# EAGLE design SI4689_Fm_Module (EAGLE 7.5.0)
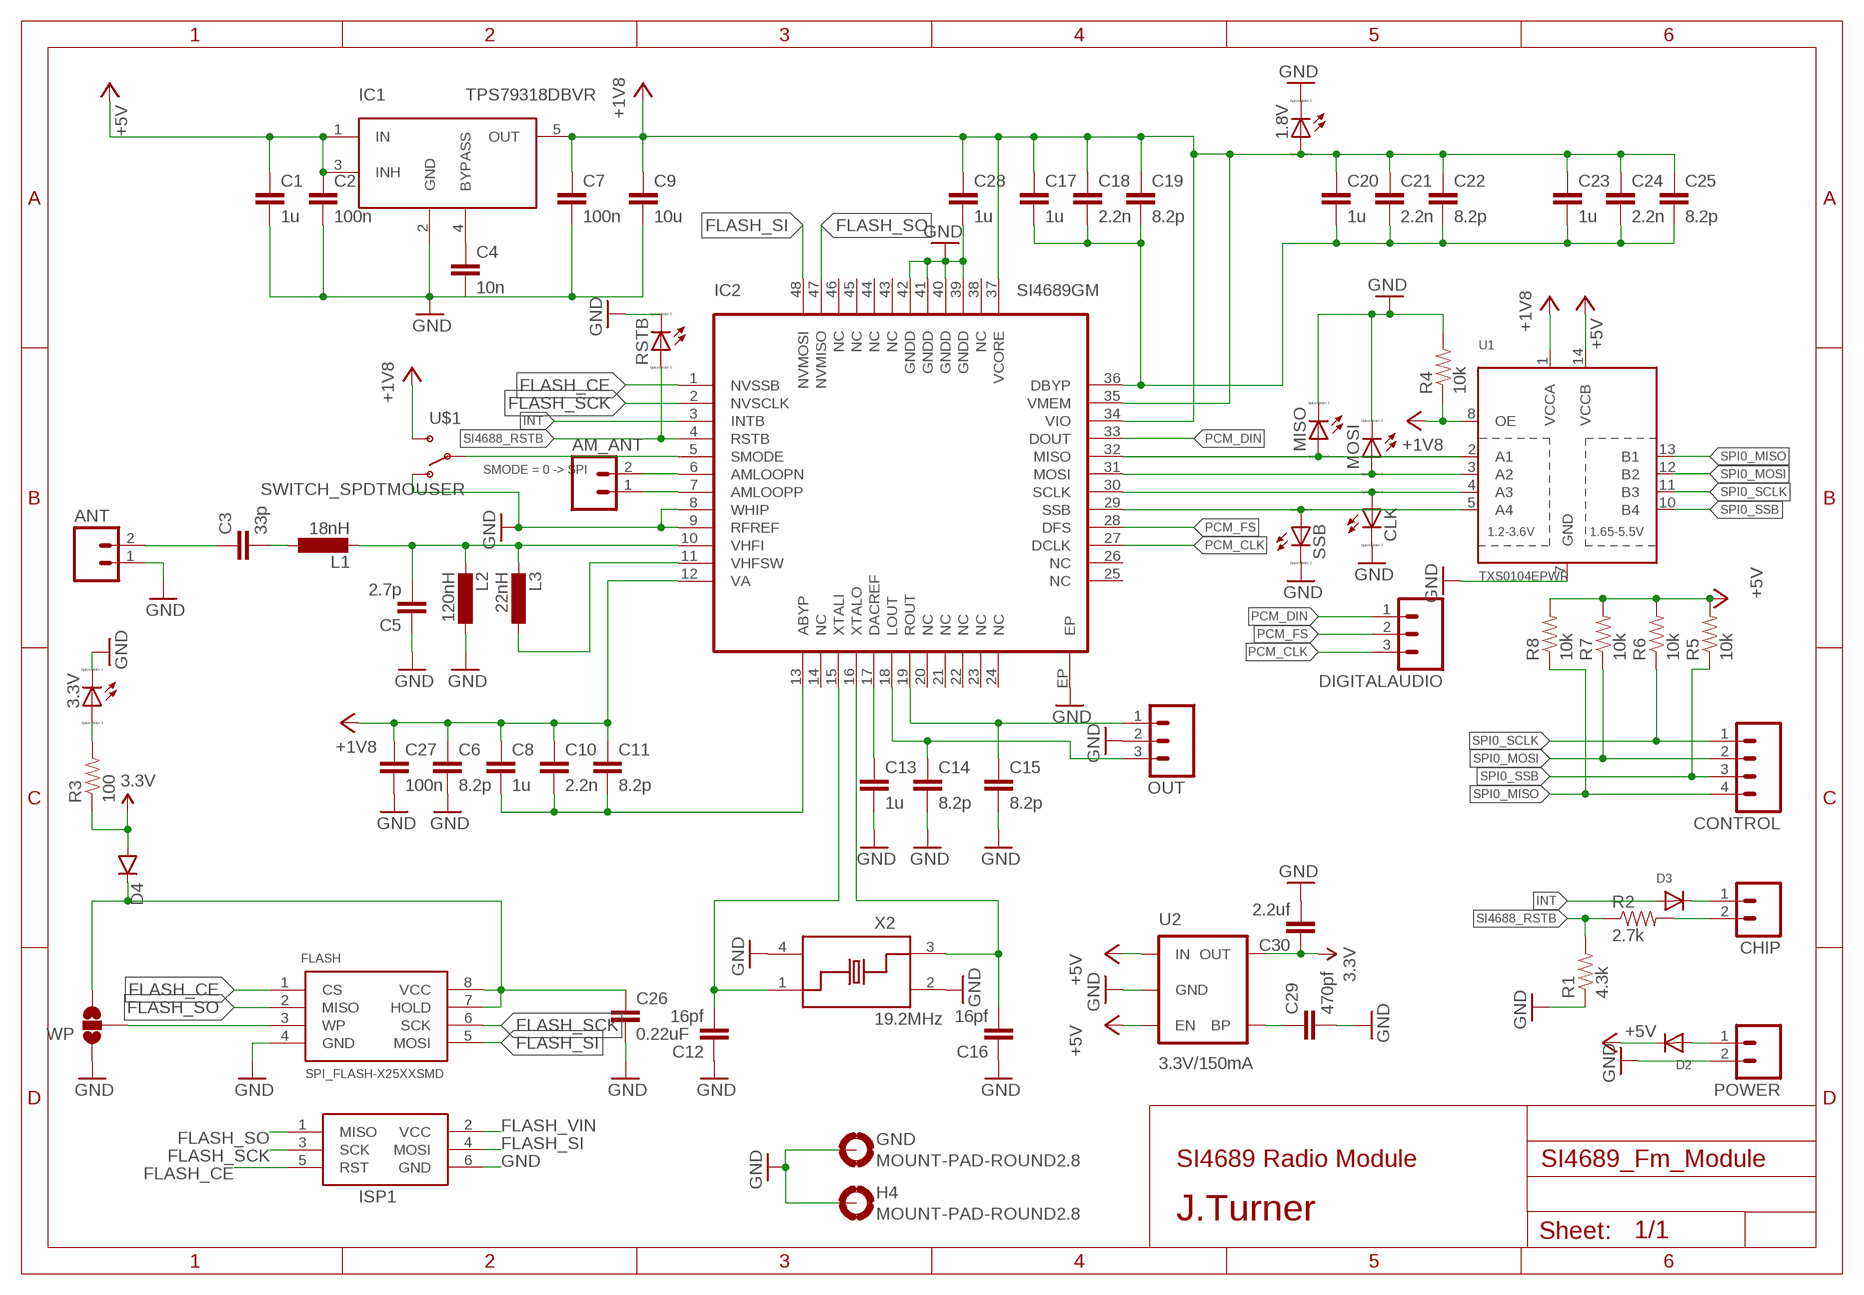
[diagram p0: schematic, sheet 1]

## Parts
1.8V  LED_ESML0603  [LED_SML0603]
3.3V  LED_ESML0603  [LED_SML0603]
AM_ANT  M02  [02P]
ANT  M02  [02P]
C1  1u  C0603  [SMD0603]
C2  100n  C0603  [SMD0603]
C3  33p  0603CAP  [0603-CAP]
C4  10n  C0603  [SMD0603]
C5  2.7p  0603CAP  [0603-CAP]
C6  8.2p  C0603  [SMD0603]
C7  100n  C0603  [SMD0603]
C8  1u  C0603  [SMD0603]
C9  10u  C0603  [SMD0603]
C10  2.2n  C0603  [SMD0603]
C11  8.2p  C0603  [SMD0603]
C12  16pf  0603CAP  [0603-CAP]
C13  1u  C0603  [SMD0603]
C14  8.2p  C0603  [SMD0603]
C15  8.2p  C0603  [SMD0603]
C16  16pf  0603CAP  [0603-CAP]
C17  1u  C0603  [SMD0603]
C18  2.2n  C0603  [SMD0603]
C19  8.2p  C0603  [SMD0603]
C20  1u  C0603  [SMD0603]
C21  2.2n  C0603  [SMD0603]
C22  8.2p  C0603  [SMD0603]
C23  1u  C0603  [SMD0603]
C24  2.2n  C0603  [SMD0603]
C25  8.2p  C0603  [SMD0603]
C26  0.22uF  0603CAP  [0603-CAP]
C27  100n  C0603  [SMD0603]
C28  1u  C0603  [SMD0603]
C29  470pf  0603CAP  [0603-CAP]
C30  2.2uf  0603CAP  [0603-CAP]
CHIP  M02  [02P]
CLK  LED_ESML0603  [LED_SML0603]
CONTROL  M04  [04P]
D2  DIODESOD-323F  [SOD-323F]
D3  DIODESOD-323F  [SOD-323F]
D4  DIODESOD523  [SOD523]
DIGITALAUDIO  M03  [03P]
FLASH  SPI_FLASH-X25XXSMD  [SO08]
GND  MOUNT-PAD-ROUND2.8  [2,8-PAD]
H4  MOUNT-PAD-ROUND2.8  [2,8-PAD]
IC1  TPS79318DBVR  [SOT23-5]
IC2  SI4689GM  [QFN48]
ISP1  AVRISP-6  [AVRISP]
L1  18nH  L0402  [SMD0402]
L2  120nH  L0402  [SMD0402]
L3  22nH  L0402  [SMD0402]
MISO  LED_ESML0603  [LED_SML0603]
MOSI  LED_ESML0603  [LED_SML0603]
OUT  M03  [03P]
POWER  M02  [02P]
R1  4.3k  RESISTOR0603  [0603-RES]
R2  2.7k  RESISTOR0603  [0603-RES]
R3  100  RESISTOR0603  [0603-RES]
R4  10k  RESISTOR0603  [0603-RES]
R5  10k  RESISTOR0603  [0603-RES]
R6  10k  RESISTOR0603  [0603-RES]
R7  10k  RESISTOR0603  [0603-RES]
R8  10k  RESISTOR0603  [0603-RES]
RSTB  LED_ESML0603  [LED_SML0603]
SSB  LED_ESML0603  [LED_SML0603]
U1  TXS0104EPWR  [TSSOP14]
U2  3.3V/150mA  V_REG_MIC52053.3V  [SOT23-5]
U$1  SWITCH_SPDTMOUSER  [SSSS810701]
WP  SOLDERJUMPER_2WAYS  [SJ_3]
X2  19.2MHz  XTAL_3.2X2.5  [XTAL_3.2X2.5]

## Nets
3.3V: C30.1 D4.A R3.1 U2.5(OUT)
+1V8: 1.8V.A C6.1 C7.1 C8.1 C9.1 C10.1 C11.1 C17.1 C18.1 C19.1 C20.1 C21.1 C22.1 C23.1 C24.1 C25.1 C27.1 C28.1 IC1.5(OUT) IC2.12(VA) IC2.34(VIO) IC2.35(VMEM) IC2.37(VCORE) R4.1 U1.1(VCCA) U1.8(OE) U$1.S
FLASH_CE: FLASH.1(CS) IC2.1(NVSSB) ISP1.5(RST)
FLASH_SCK: FLASH.6(SCK) IC2.2(NVSCLK) ISP1.3(SCK)
FLASH_SI: FLASH.5(MOSI) IC2.48(NVMOSI) ISP1.4(MOSI)
FLASH_SO: FLASH.2(MISO) IC2.47(NVMISO) ISP1.1(MISO)
FLASH_VIN: C26.1 D4.C FLASH.7(HOLD) FLASH.8(VCC) ISP1.2(VCC) WP.3
GND: 1.8V.C 3.3V.C ANT.1 C1.2 C2.2 C4.2 C5.1 C6.2 C7.2 C9.2 C12.1 C13.2 C14.2 C15.2 C16.1 C26.2 C27.2 C28.2 C29.2 C30.2 CLK.C FLASH.4(GND) GND.B2,8(MOUNT) H4.B2,8(MOUNT) IC1.2(GND) IC2.8(WHIP) IC2.9(RFREF) IC2.39(GNDD) IC2.40(GNDD) IC2.41(GNDD) IC2.42(GNDD) IC2.EP ISP1.6(GND) L2.1 MISO.C MOSI.C OUT.2 POWER.2 R1.1 R4.2 RSTB.C SSB.C U1.7(GND) U2.2(GND) U$1.O WP.1 X2.2(GND) X2.4(GND)
INT: D3.A IC2.3(INTB)
LDO_IN: C1.1 C2.1 D2.C IC1.1(IN) IC1.3(INH) R5.2 R6.2 R7.2 R8.2 U1.14(VCCB) U2.1(IN) U2.3(EN) ; supply symbol labelled +5V
N$1: C3.2 L1.1
N$2: C5.2 IC2.10(VHFI) L1.2 L2.2 L3.2
N$3: IC2.11(VHFSW) L3.1
N$4: C8.2 C10.2 C11.2 IC2.13(ABYP)
N$5: C17.2 C18.2 C19.2 C20.2 C21.2 C22.2 C23.2 C24.2 C25.2 IC2.36(DBYP)
N$6: C12.2 IC2.15(XTALI) X2.1
N$7: C16.2 IC2.16(XTALO) X2.3
N$8: C13.1 IC2.17(DACREF)
N$10: CHIP.1 D3.C
N$11: C4.1 IC1.4(BYPASS)
N$12: C29.1 U2.4(BP)
N$13: 3.3V.A R3.2
N$14: FLASH.3(WP) WP.2
N$15: AM_ANT.1 IC2.7(AMLOOPP)
N$16: AM_ANT.2 IC2.6(AMLOOPN)
N$17: IC2.5(SMODE) U$1.P
N$18: CHIP.2 R2.2
N$19: D2.A POWER.1
PCM_CLK: DIGITALAUDIO.3 IC2.27(DCLK)
PCM_DIN: DIGITALAUDIO.1 IC2.33(DOUT)
PCM_FS: DIGITALAUDIO.2 IC2.28(DFS)
RF_IN: ANT.2 C3.1
SI4688_LOUT: C14.1 IC2.18(LOUT) OUT.3
SI4688_ROUT: C15.1 IC2.19(ROUT) OUT.1
SI4688_RSTB: IC2.4(RSTB) R1.2 R2.1 RSTB.A
SPI0_CE0_N18: IC2.29(SSB) SSB.A U1.5(A4)
SPI0_MISO: CONTROL.4 R8.1 U1.13(B1)
SPI0_MISO18: IC2.32(MISO) MISO.A U1.2(A1)
SPI0_MOSI: CONTROL.2 R7.1 U1.12(B2)
SPI0_MOSI18: IC2.31(MOSI) MOSI.A U1.3(A2)
SPI0_SCLK: CONTROL.1 R6.1 U1.11(B3)
SPI0_SCLK18: CLK.A IC2.30(SCLK) U1.4(A3)
SPI0_SSB: CONTROL.3 R5.1 U1.10(B4)
Unconnected: IC2.14(NC) IC2.20(NC) IC2.21(NC) IC2.22(NC) IC2.23(NC) IC2.24(NC) IC2.25(NC) IC2.26(NC) IC2.38(NC) IC2.43(NC) IC2.44(NC) IC2.45(NC) IC2.46(NC)

## Notes on the sheet
- SMODE = 0 -> SPI
- SI4689 Radio Module
- J.Turner

## Library data of the parts
1.8V 3.3V CLK MISO MOSI RSTB SSB = eagle-ltspice:LED_E: LED Source: http://www.osram.convergy.de Source: www.luxeon.com Source: www.kingbright.com; SPICEMODEL: NONE; SPICEPREFIX: D; SPICETYPE: diode
AM_ANT ANT CHIP POWER = con-amp-quick:M02: AMP QUICK CONNECTOR; OC_FARNELL: unknown; OC_NEWARK: unknown
C1 C2 C4 C6-C11 C13-C15 C17-C25 C27 C28 = generisch:C0603
C3 C5 C12 C16 C26 C29 C30 = john:0603CAP
CONTROL = con-amp-quick:M04: AMP QUICK CONNECTOR; OC_FARNELL: unknown; OC_NEWARK: unknown
D2 D3 = adafruit:DIODE: Diode
D4 = SparkFun-DiscreteSemi:DIODE: Diode
DIGITALAUDIO OUT = con-amp-quick:M03: AMP QUICK CONNECTOR; OC_FARNELL: unknown; OC_NEWARK: unknown
FLASH = SparkFun-DigitalIC:SPI_FLASH-X25XX: 8pin SPI Flash series x25xx. Works with devices like W25X32 and BR25L32
GND H4 = holes:MOUNT-PAD-ROUND: MOUNTING PAD, round
IC1 = ldo_reg:TPS79318DBVR
IC2 = john:SI4689
ISP1 = adafruit:AVRISP: AVR ISP HEADER Standard 6 pin header for AVR programming
L1-L3 = generisch:L0402
R1-R8 = john:RESISTOR: Resistor Basic schematic elements and footprints for 0603, 1206, and PTH resistors.
U1 = john:TXS0104EPWR
U2 = SparkFun-PowerIC:V_REG_MIC5205: V_REG MIC5205 Standard 3.3V, 5V, and Adjustable 150mA LDO voltage regulator in SOT-23 layout. Micrel part MIC5205. BP (by-pass) pin is used to lower output noise with 470pF cap, may be left open. On the adjustable version BP is used to set output.; PROD_ID: VREG-00822
U$1 = SparkFun-Electromechanical:SWITCH_SPDT: SWCH-10651 Side-actuated SPDT slide switch, as used on the Arduino Pro
WP = SparkFun-Retired:SOLDERJUMPER_2WAY: Solder Jumper 2 way solder jumper
X2 = generisch:XTAL_3.2X2.5

## Board
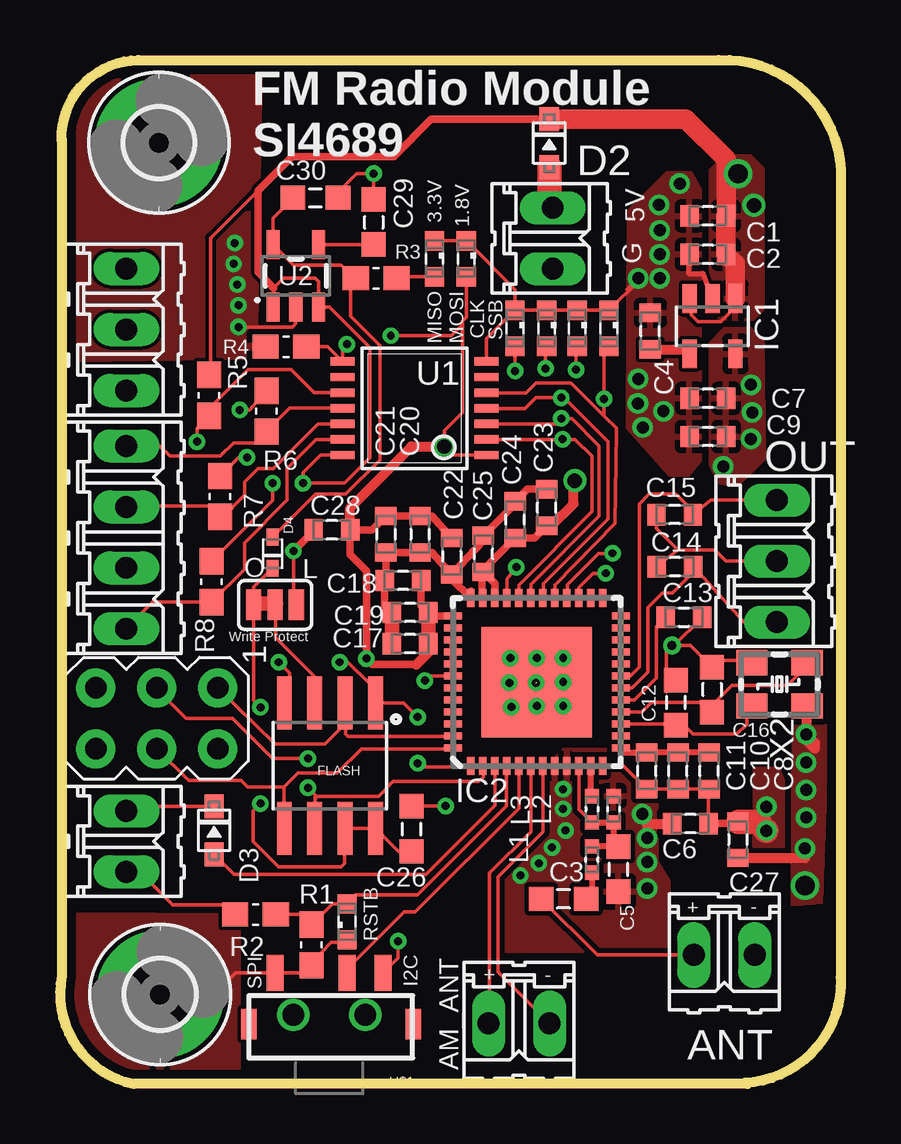
[diagram p1: board, top side]
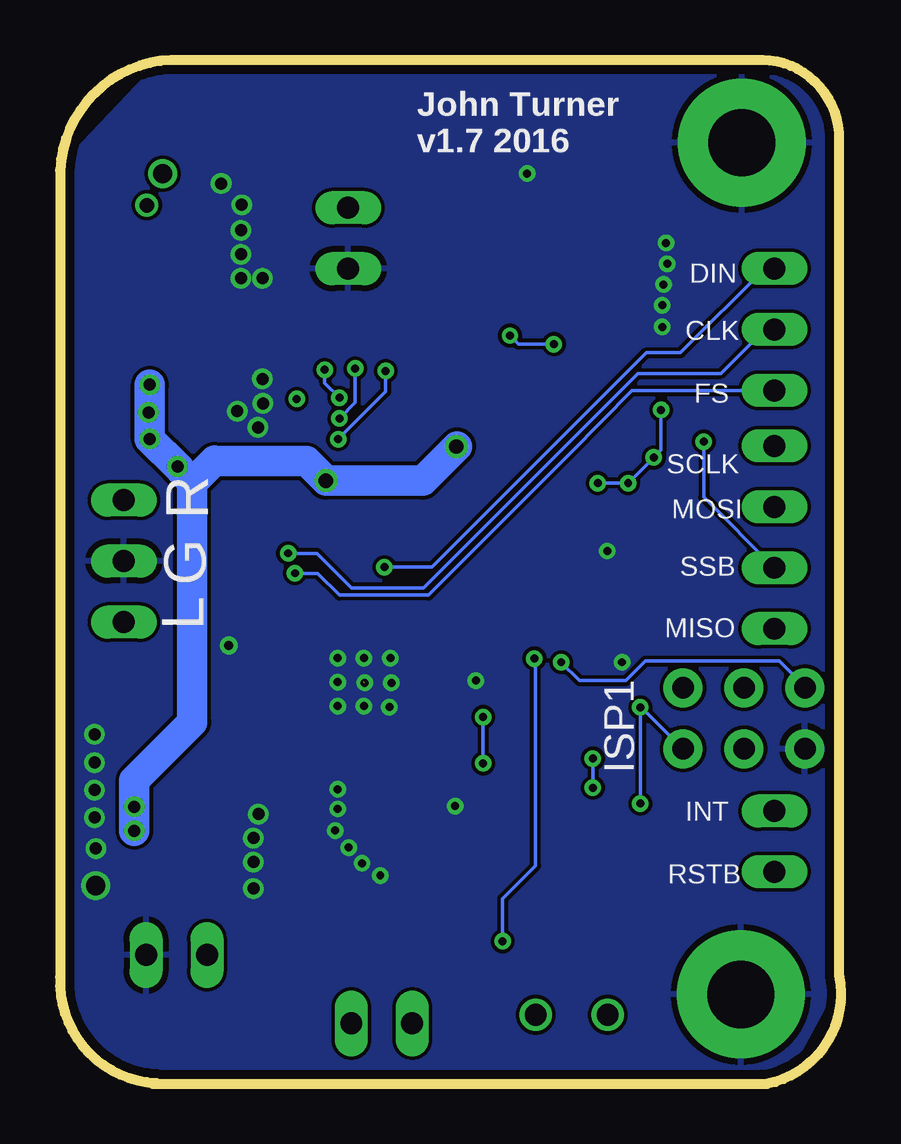
[diagram p2: board, bottom side, seen from below]

Size 32.55 x 42.68 mm. Coordinates in mm from the lower left corner, seen from the top.
Outline: 0.06,39.35 arc-90 3.26,42.68 27.47,42.68 arc-90 32.55,38.09 32.55,4.46 arc-90 28.53,0.04
Outline: 0.08,39.37 0.08,4.52 arc90 3.07,0 28.68,0
Copper layers (1*16): Top 0.0356mm / dielectric 1.5011mm / Bottom 0.0356mm
Design rules "LaenPCBOrder": minimum track width 6mil, minimum drill 13mil, track to track 6mil, track to pad 6mil, pad to pad 6mil, via to via 6mil, smd to smd 6mil, copper to edge 15mil, drill to drill 6mil, minimum pad ring 7mil, minimum via ring 7mil, stop-mask expansion 3mil, vias tented up to drill 0mil, thermal gap 10mil

### Footprints (pad centres in the part's own frame; a part is rotated, then mirrored left to right if it is on the bottom)
LED_SML0603 = smd 0.8 x 0.8: A 0.75,0; C -0.75,0
02P = drill 0.914 long: 1 -1.27,0.254; 2 1.27,0.254
SMD0603 = smd 0.762 x 0.889: 1 -0.762,0; 2 0.762,0
0603-CAP = smd 1.016 x 1: 1 -0.926,0 | smd 1.024 x 1: 2 0.952,0
04P = drill 0.914 long: 1 -3.835,0.254; 2 -1.295,0.254; 3 1.245,0.254; 4 3.785,0.254
SOD-323F = smd 1 x 0.8: A -1,0; C 1,0
SOD523 = smd 0.7 x 0.5: A 0.7,0; C -0.6,0
03P = drill 0.914 long: 1 -2.54,0.254; 2 0,0.254; 3 2.54,0.254
SO08 = smd 0.61 x 2.21: 1 -1.905,-2.616; 2 -0.635,-2.616; 3 0.635,-2.616; 4 1.905,-2.616; 5 1.905,2.616; 6 0.635,2.616; 7 -0.635,2.616; 8 -1.905,2.616
2,8-PAD = drill 2.8 pad 5.334: B2,8 0,0
SOT23-5 = smd 0.6 x 1.2: 1 -0.95,-1.15; 2 0,-1.15; 3 0.95,-1.15; 4 0.95,1.15; 5 -0.95,1.15
QFN48 = smd 0.75 x 0.3: 1 -3.5,2.75; 2 -3.5,2.25; 3 -3.5,1.75; 4 -3.5,1.25; 5 -3.5,0.75; 6 -3.5,0.25; 7 -3.5,-0.25; 8 -3.5,-0.75; 9 -3.5,-1.25; 10 -3.5,-1.75; 11 -3.5,-2.25; 12 -3.5,-2.75; 25 3.5,-2.75; 26 3.5,-2.25; 27 3.5,-1.75; 28 3.5,-1.25; 29 3.5,-0.75; 30 3.5,-0.25; 31 3.5,0.25; 32 3.5,0.75; 33 3.5,1.25; 34 3.5,1.75; 35 3.5,2.25; 36 3.5,2.75 | smd 0.3 x 0.75: 13 -2.75,-3.5; 14 -2.25,-3.5; 15 -1.75,-3.5; 16 -1.25,-3.5; 17 -0.75,-3.5; 18 -0.25,-3.5; 19 0.25,-3.5; 20 0.75,-3.5; 21 1.25,-3.5; 22 1.75,-3.5; 23 2.25,-3.5; 24 2.75,-3.5; 37 2.75,3.5; 38 2.25,3.5; 39 1.75,3.5; 40 1.25,3.5; 41 0.75,3.5; 42 0.25,3.5; 43 -0.25,3.5; 44 -0.75,3.5; 45 -1.25,3.5; 46 -1.75,3.5; 47 -2.25,3.5; 48 -2.75,3.5 | smd 4.6 x 4.6: EP 0,0
AVRISP = drill 0.9 pad 1.626: 1 -1.27,2.54; 2 1.27,2.54; 3 -1.27,0; 4 1.27,0; 5 -1.27,-2.54; 6 1.27,-2.54
SMD0402 = smd 0.6 x 0.6: 1 -0.55,0; 2 0.55,0
0603-RES = smd 1.1 x 1: 1 -0.85,0; 2 0.85,0
TSSOP14 = smd 0.35 x 1: 1 -1.95,-3; 2 -1.3,-3; 3 -0.65,-3; 4 0,-3; 5 0.65,-3; 6 1.3,-3; 7 1.95,-3; 8 1.95,3; 9 1.3,3; 10 0.65,3; 11 0,3; 12 -0.65,3; 13 -1.3,3; 14 -1.95,3
SOT23-5' = smd 0.55 x 1.2: 1 -0.95,-1.3; 2 0,-1.3; 3 0.95,-1.3; 4 0.95,1.3; 5 -0.95,1.3
SSSS810701 = smd 0.635 x 1.27: 1 -1.651,0.508; 2 5.207,0.508 | smd 0.7 x 1.5: O -0.55,2.65; P 2.45,2.65; S 3.95,2.65 | drill 0.9: P$5 3.2,0.9; P$6 0.2,0.9
SJ_3 = smd 0.635 x 1.27: 1 -0.889,0; 2 0,0; 3 0.889,0
XTAL_3.2X2.5 = smd 1.3 x 1.05: 1 -1.15,-0.9; 2 1.15,-0.9; 3 1.15,0.9; 4 -1.15,0.9

### Placement (x,y rotation side)
1.8V  16.94,34.39 270 top
3.3V  15.62,34.39 270 top
AM_ANT  19.14,2.78 180 top
ANT  27.69,5.63 180 top
C1  27.01,36.18 180 top
C2  27.01,34.58 180 top
C3  20.99,7.72 0 top
C4  24.61,31.38 90 top
C5  23.28,8.94 90 top
C6  26.28,10.85 180 top
C7  27.01,28.58 180 top
C8  27.06,13.05 90 top
C9  27.01,26.98 180 top
C10  25.76,13.05 90 top
C11  24.46,13.05 90 top
C12  25.68,15.9 270 top
C13  26.01,19.45 0 top
C14  25.64,21.56 180 top
C15  25.62,23.73 180 top
C16  27.19,16.44 270 top
C17  14.6,18.35 180 top
C18  14.3,20.98 180 top
C19  14.6,19.65 180 top
C20  15.01,22.91 270 top
C21  13.59,22.91 270 top
C22  16.33,22 270 top
C23  20.29,24.03 90 top
C24  18.97,23.52 90 top
C25  17.65,22.1 90 top
C26  14.66,10.62 90 top
C27  28.26,10.18 270 top
C28  11.34,23.09 180 top
C29  13.08,35.92 90 top
C30  10.64,36.93 0 top
CHIP  2.51,10.11 270 top
CLK  21.56,31.5 270 top
CONTROL  2.51,22.76 270 top
D2  20.4,39.22 90 top
D3  6.43,10.57 90 top
D4  8.86,22.1 90 top
DIGITALAUDIO  2.51,31.45 270 top
FLASH  11.25,13.26 180 top
GND  4.12,39.23 0 top
H4  4.17,3.73 0 top
IC1  27.21,31.58 180 top
IC2  19.88,16.75 90 top
ISP1  4.04,15.24 270 top
L1  22.18,9.35 90 top
L2  23.08,11.45 270 top
L3  22.18,11.45 270 top
MISO  18.97,31.5 270 top
MOSI  20.29,31.5 270 top
OUT  29.64,21.79 270 top
POWER  20.29,35.25 270 top
R1  10.49,5.79 90 top
R2  8.15,7.06 180 top
R3  13.18,33.58 0 top
R4  9.42,30.73 180 top
R5  6.22,28.7 90 top
R6  8.61,28.04 90 top
R7  6.68,24.49 90 top
R8  6.32,20.93 90 top
RSTB  11.96,6.76 90 top
SSB  22.89,31.5 270 top
U1  14.78,28.16 90 top
U2  3.3V/150mA  [SOT23-5']  9.83,33.68 0 top
U$1  9.52,1.98 0 top
WP  8.97,19.96 180 top
X2  29.99,16.65 0 top

### Tracks (layer width: path | path; a pad name or v marks a point on that pad's centre or on a via)
3.3V
  Top 0.152: C30.1 8.88,36.1 U2.5 9.74,34.12 11.72,34.12 12.01,33.83 12.01,33.73 12.18,33.73 R3.1 12.12,33.36 12.12,32 13.34,30.78 13.34,26.01 11.91,24.59 10.65,24.59 D4.A
+1V8  (via drill 0.33, 0.5, 0.6)
  Top 0.152: C11.1 25.23,12.29 | IC2.12 22.66,13.28 23.47,13.28 C11.1 | 12.07,23.13 C28.1 | R4.1 11.16,30.73 U1.8 11.78,30.66 v11.96,30.84 | C11.1 C10.1 C8.1 27.04,12.26 C6.1 | 16.79,31.65 16.79,31.8 16.94,31.95 1.8V.A | 16.79,31.65 16.79,27.99 16.03,27.23 v16.03,26.57 16.39,26.21 U1.1 | v13.79,31.19 16.33,31.19 16.79,31.65 | U$1.S 14.1,5.25 v14.1,5.94
  Top 0.305: C27.1 28.17,10.85 C6.1 | IC2.37 15.51,19.5 arc-90 C19.1 15.06,19.95 C18.1 | C22.1 15.52,23.67 C20.1 C21.1 13.01,23.09 C28.1 12.1,22.06 12.78,21.39 v12.78,17.73 13.03,17.48 14.86,17.48 | C25.1 17.65,21.44 C24.1 19.79,22.76 C23.1 | C25.1 18.13,20.86 IC2.34 | IC2.35 17.6,20.22 17.6,21.29 C25.1
  Top 0.406: 14.86,17.48 15.36,17.98 C17.1 | C23.1 20.5,23.27 21.41,24.18 21.41,25.1 v21.46,25.15 | C28.1 12.1,24.01 14.66,26.57 v16.03,26.57
  Top 0.61: C19.1 C17.1
  Top 0.813: C27.1 28.28,10.92
  Top 1.016: 28.28,10.92 29.08,10.92 v29.46,10.55
  Bottom 0.152: v12.78,17.73 12.73,17.68 12.73,9.09 14.1,7.72 v14.1,5.94 | 16,26.57 v16.03,26.57 | v11.96,30.84 13.44,30.84 v13.79,31.19
  Bottom 1.27: 27.03,25.06 26.11,25.98 26.09,25.96 22.28,25.96 v21.46,25.15 17.42,25.15 16,26.57 | v29.46,10.55 29.46,12.65 27.03,15.07 27.03,25.06 | 27.03,25.06 v27.65,25.73 v28.81,26.89 v28.81,29.14
  other vias: 28.86,27.99 29.46,11.55
  pour Top (isolate 0.2): 30.16,12.65 30.16,10.65 30.16,9.84 28.93,9.84 28.93,10.31 28.88,10.66 28.88,11.04 28.96,11.35 28.96,13.15 29.96,13.15
  pour Top: 27.11,30.88 27.11,25.79 27.51,25.04 28.25,24.94 29.36,26.05 29.31,30.98 28.81,31.48 27.71,31.48
FLASH_CE  (via drill 0.33)
  Top 0.152: IC2.1 17.09,13.21 15.06,13.21 v14.91,13.36 | v14.91,15.29 14.33,15.88 FLASH.1 12.93,16.1 12.93,16.66 12.01,17.58 v11.66,17.58
  Bottom 0.152: v14.91,15.29 v14.91,13.36 | ISP1.5 1.5,16.56 2.57,17.63 8.15,17.63 8.97,16.81 10.9,16.81 v11.66,17.58
FLASH_SCK  (via drill 0.33)
  Top 0.152: 17.65,13.28 IC2.2 17.65,13.23 17.65,12.8 17.45,12.6 13.89,12.6 13.28,11.99 10.74,11.99 10.64,11.89 | 10.64,11.89 10.64,10.67 FLASH.6 | v10.34,13.56 8.86,13.56 7.19,15.24 5.26,15.24 4.04,16.46 ISP1.3 | v10.34,12.34 10.64,12.04 10.64,11.89
  Bottom 0.152: v10.34,13.56 v10.34,12.34
FLASH_SI
  Top 0.152: IC2.48 16.35,13.97 12.57,13.97 11.56,12.95 9.93,12.95 9.35,12.37 | 9.37,10.67 FLASH.5 9.35,12.37 | 9.35,12.37 7.82,12.37 7.54,12.65 5.36,12.65 ISP1.4
FLASH_SO
  Top 0.152: IC2.47 16.36,14.48 12.01,14.48 11.91,14.58 11.91,15.85 FLASH.2 11.89,15.01 11.05,14.17 8.97,14.17 ISP1.1
FLASH_VIN  (via drill 0.33)
  Top 0.152: C26.1 14.11,9.69 FLASH.8 FLASH.7 11.86,10.62 11.86,9.19 11.71,9.04 9.12,9.04 8.05,10.11 8.05,11.38 v8.36,11.68 | D4.C 8.08,20.71 WP.3 8.08,15.98 v8.36,15.7
  Bottom 0.152: v8.36,11.68 v8.36,15.7 8.31,15.7 ISP1.2
GND  (via drill 0.33, 0.33 pad 0.3, 0.38, 0.5, 0.8)  (1 unrouted)
  Top 0.152: C28.2 10.58,23.05 | 21.11,13.27 IC2.9 | C12.1 25.27,16.35 25.27,18.03 v25.52,18.27 | 24.56,32.19 C4.2 | 11.39,36.83 C30.2 11.59,37.17 12.37,37.95 v13.08,37.95 C29.2 | X2.4 28.54,17.66 27.45,17.66 C16.1 26.28,18.27 v25.52,18.27 | v7.44,31.55 9.69,31.55 9.83,31.69 U2.2 | 23.64,33.11 v24.11,33.58 24.11,33.47 SSB.C CLK.C MOSI.C MISO.C | 3.3V.C 1.8V.C 18.97,33.11 MISO.C | R4.2 8.71,30.73 | C14.2 25.77,22.25 | 25.77,22.25 27.31,22.25 27.77,21.79 OUT.2 | C15.2 24.86,23.16 25.77,22.25 | v25.52,18.27 25.59,18.27 C13.2 | WP.1 9.73,20.09 v9.73,22.21 | 6.43,3.73 7.33,4.63 U$1.O 10.18,4.63 R1.1 10.9,4.94 10.9,5.49 11.3,5.89 11.85,5.89 RSTB.C | IC2.42 15.4,17 v15.21,16.81 | FLASH.4 9.58,15.65 9.58,17.12 v9.12,17.58 | C26.2 14.67,11.58 v16.08,11.58 | U1.7 17.78,31.06 MISO.C
  Top 0.204: C2.2 26.21,33.78 26.81,33.78 IC1.2
  Top 0.254: L2.1 23.13,11.95 | C6.2 25.48,10.81
  Top 0.305: IC2.42 IC2.41 IC2.40 IC2.39 | 10.58,23.05 v9.73,22.21
  Top 0.406: v19.85,16.72 18.73,15.6 18.36,15.6 19.52,16.75 | v31.11,14.57 31.47,14.21 31.47,13.97 31.14,14.3 X2.2 | 25.48,10.81 24.48,10.81 v24.48,10.25 | C27.2 31.06,9.42 v31.06,9.81
  other vias: 24.28,11.25 20.98,16.75 20.98,17.75 20.98,15.75 19.88,17.75 19.88,15.75 18.73,16.72 18.78,17.75 21.08,10.56 20.98,12.28 24.48,9.25 24.48,8.15 18.82,15.7 25.01,35.58 25.01,34.58 25.01,33.58 25.83,37.53 24.97,36.65 24.09,28.36 24.3,27.36 25.16,28.04 24.11,29.38 31.06,8.26 31.11,11.1 31.11,12.25 31.11,13.4 20.52,9.85 20.98,11.46 19.96,9.19 19.2,8.69 7.44,32.46 7.39,33.32 7.24,34.19 7.29,35.05
  pour Top (isolate 0.2): 18.53,5.53 18.58,11.25 20.98,13.95 23.08,13.95 24.88,12.45 24.88,9.25 25.38,8.45 25.35,5.53
  pour Bottom (rank 2): 17.26,0.5 29.39,0.41 32.3,3.1 32.3,38.43 28.54,42.39 0.06,42.18 -0.04,29.9 -0.43,5.33 2.08,0.68 14.93,0.48
  pour Top: 26.31,37.98 25.31,37.98 23.71,36.38 23.66,27.33 25.41,25.38 26.21,25.38 26.71,25.98 26.71,37.28
  pour Top: 31.73,7.56 30.53,7.46 30.57,15.17 31.93,15.27 31.88,11.53
  pour Top: 0.79,7.01 7.39,6.96 7.39,0.36 2.31,0.51 1.9,0.51 1.65,0.71 1.3,1.12 0.84,1.73 0.53,2.18 0.38,3.15
  pour Top: 0.79,42.42 8.31,42.42 8.1,30.33 0.58,30.23
INT
  Top 0.152: IC2.3 18.13,11.6 15.27,8.74 7.26,8.74 D3.A
LDO_IN  (via drill 0.33, 0.6, 0.8)
  Top 0.152: IC1.1 28.16,32.37 27.56,31.77 26.6,31.77 26.32,32.05 26.32,32.67 IC1.3 | U2.1 8.92,32.42 8.92,33.17 9.32,33.58 10.64,33.58 10.78,33.44 U2.3 11.23,32.38 12.93,30.68 12.93,26.11 11.86,25.04 v10.13,25.04 10.13,25.48 10.87,26.21 U1.14 | R8.2 8.86,24.32 v8.86,25.04 | R6.2 7.91,28.09 v7.49,28.09 | R7.2 7.46,26.11 v7.8,26.11 | 8.26,37.24 6.27,35.26 6.27,29.6 R5.2
  Top 0.305: 8.92,33.17 8.26,33.83 8.26,37.24 9.68,38.66 13.92,38.66 15.48,40.22 D2.C
  Top 0.813: IC1.1 28.16,34.19 C2.1 C1.1 27.78,38.54 26.1,40.22 D2.C
  Bottom 0.152: v7.49,28.09 7.49,26.42 v7.8,26.11 v8.86,25.04 v10.13,25.04
  other vias: 28.27,37.95 28.93,36.63
  pour Top: 27.11,38.08 27.11,32.28 27.51,31.88 28.91,31.88 29.31,32.28 29.31,38.18 28.81,38.68 27.71,38.68
N$1
  Top 0.254: L1.1 22.18,7.96 C3.2
N$2
  Top 0.152: IC2.10 21.63,11.45 L3.2
  Top 0.254: L3.2 L2.2 23.08,10.1 C5.2 L1.2
N$3
  Top 0.254: L3.1 22.13,12.05 IC2.11
N$4
  Top 0.254: IC2.13 23.57,13.81 C11.2 C10.2 C8.2
N$5
  Top 0.305: C19.2 13.54,19.95 C18.2 13.59,21.03 C21.2 C20.2 15.52,22.15 C22.2 | 17.13,20.54 IC2.36 16.33,21.05 C22.2 | C25.2 18.97,24.18 C24.2 19.48,24.79 C23.2 | C22.2 17.65,22.66
  Top 0.406: C21.2 13.54,22.1 | 17.65,22.66 C25.2
  Top 0.61: C19.2 C17.2
N$6
  Top 0.152: IC2.15 25.22,15 C12.2 25.92,15.05 26.39,14.58 28.22,14.58 28.63,14.99 28.63,15.84 X2.1
N$7
  Top 0.152: IC2.16 24.26,15.5 24.66,15.9 26.88,15.9 C16.2 26.98,15.68 27.39,15.68 27.39,15.99 28.02,16.61 30.33,16.61 31.14,17.43 X2.3
N$8
  Top 0.152: C13.1 24.87,19.07 24.87,16.92 23.95,16 IC2.17
N$10
  Top 0.152: CHIP.1 2.95,11.56 D3.C
N$11
  Top 0.406: C4.1 26.07,30.62 IC1.4
N$12
  Top 0.152: 10.9,35.1 U2.4 C29.1
N$13
  Top 0.152: R3.2 14.1,33.64 3.3V.A
N$14
  Top 0.152: WP.2 8.99,19.94 8.99,18.62 10.62,16.99 FLASH.3
N$15
  Top 0.152: IC2.7 20.13,10.5 18.26,8.64 18.26,4.67 AM_ANT.1
N$16
  Top 0.152: IC2.6 19.63,10.51 17.91,8.79 17.91,2.56 AM_ANT.2
N$17
  Top 0.152: IC2.5 19.13,11.48 14.81,7.16 14.35,7.16 11.98,4.79 U$1.P 11.98,4.33
N$18
  Top 0.152: R2.2 6.9,7.47 4.7,7.47 3.33,8.84 CHIP.2
N$19
  Top 1.016: POWER.1 20.4,36.66 D2.A
N$20
  Top 0.61: 8.1,20.02 9.02,20.02
PCM_CLK  (via drill 0.33)
  Top 0.152: IC2.27 21.63,20.69 22.23,21.29 v22.76,21.29
  Bottom 0.152: v22.76,21.29 21.82,21.29 20.9,20.37 17.2,20.37 11.25,26.31 8.71,28.91 DIGITALAUDIO.3
PCM_DIN  (via drill 0.33)
  Top 0.152: IC2.33 18.63,21.04 v19.02,21.54
  Bottom 0.152: DIGITALAUDIO.1 3.18,33.99 6.68,30.48 8.1,30.48 17.04,21.54 v19.02,21.54
PCM_FS  (via drill 0.33)
  Top 0.152: IC2.28 21.15,20.47 21.15,20.82 22.45,22.12 v23.04,22.12
  Bottom 0.152: v23.04,22.12 21.84,22.12 20.4,20.68 17.4,20.68 8.46,29.62 5,29.62 3.18,31.45 DIGITALAUDIO.2
RF_IN
  Top 0.152: C3.1 22.4,5.38 ANT.2
  Top 0.254: C3.1 19.98,7.64
SI4688_LOUT
  Top 0.152: IC2.18 23.84,16.5 24.51,17.17 24.51,19.86 25.12,20.47 25.53,20.47 26.4,21.34 C14.1 28.5,19.25 OUT.3
SI4688_ROUT
  Top 0.152: IC2.19 23.78,17 24.16,17.37 24.16,24.18 24.56,24.59 25.68,24.59 26.39,23.88 C15.1 27.14,24.33 OUT.1
SI4688_RSTB
  Top 0.152: IC2.4 18.62,13.24 18.62,11.58 14.91,7.87 12.33,7.87 RSTB.A 11.36,7.51 R1.2 10.07,7.06 R2.1
SPI0_CE0_N18  (via drill 0.33)
  Top 0.152: IC2.29 20.63,20.81 23.14,23.37 23.19,27.18 23.19,27.33 22.68,27.84 | U1.5 19.43,28.8 19.84,29.21 21.31,29.21 22.68,27.84 | 22.68,27.84 v22.68,28.55 22.68,30.44 SSB.A
SPI0_MISO
  Top 0.152: CONTROL.4 3.87,20.08 R8.1 7.7,21.45 7.7,22.56 9.47,24.33 9.47,25.65 10.68,26.86 U1.13
SPI0_MISO18  (via drill 0.33)
  Top 0.152: IC2.32 19.13,20.8 22.17,23.85 22.17,26.16 21.48,26.86 20.97,26.86 | 20.97,26.86 v20.96,26.87 | 20.97,26.86 U1.2 | v18.97,29.72 MISO.A
  Bottom 0.152: v18.97,29.72 18.97,28.85 v20.96,26.87
SPI0_MOSI
  Top 0.152: R7.1 6.95,23.99 | R7.1 6.58,24.08 2.79,24.08 CONTROL.2 | 6.68,23.98 R7.1 | R7.1 6.8,23.64 7.7,24.54 7.7,25.1 8.26,25.65 8.9,25.65 10.76,27.51 U1.12
SPI0_MOSI18  (via drill 0.33)
  Top 0.152: IC2.31 19.63,20.82 22.48,23.67 22.48,26.59 21.34,27.74 v20.9,27.74 20.68,27.51 U1.3 arc-90 17.81,27.53 | v20.24,29.82 20.24,30.7 arc-90 MOSI.A
  Bottom 0.152: v20.24,29.82 20.24,28.4 v20.9,27.74
SPI0_SCLK
  Top 0.152: CONTROL.1 4.17,26.59 4.6,26.16 6.68,26.16 7.24,26.72 8.24,26.72 R6.1 9.58,28.16 U1.11
SPI0_SCLK18  (via drill 0.33)
  Top 0.152: IC2.30 20.15,20.28 20.15,20.86 22.83,23.55 22.83,26.77 21.01,28.6 v20.9,28.6 19.84,28.6 19.38,28.14 17.8,28.14 U1.4 | v21.51,29.77 21.51,30.7 arc-90 CLK.A
  Bottom 0.152: v20.9,28.6 21.51,29.21 v21.51,29.77
SPI0_SSB  (via drill 0.33)
  Top 0.152: v5.72,26.77 5.72,27.34 R5.1 6.22,28.14 7.85,29.77 9.63,29.77 10.58,28.81 U1.10
  Bottom 0.152: v5.72,26.77 5.72,24.46 CONTROL.3

### Text on the board
tPlace: FM Radio Module / SI4689
bPlace: John Turner / v1.7 2016
tNames: 5V | G | O | L | Write Protect | + | - | SPI | I2C | + | -
bNames: DIN | CLK | FS | SCLK | R | MOSI | G | SSB | MISO | L | INT | RSTB